# Altium project PSU4PSU.PrjPcb
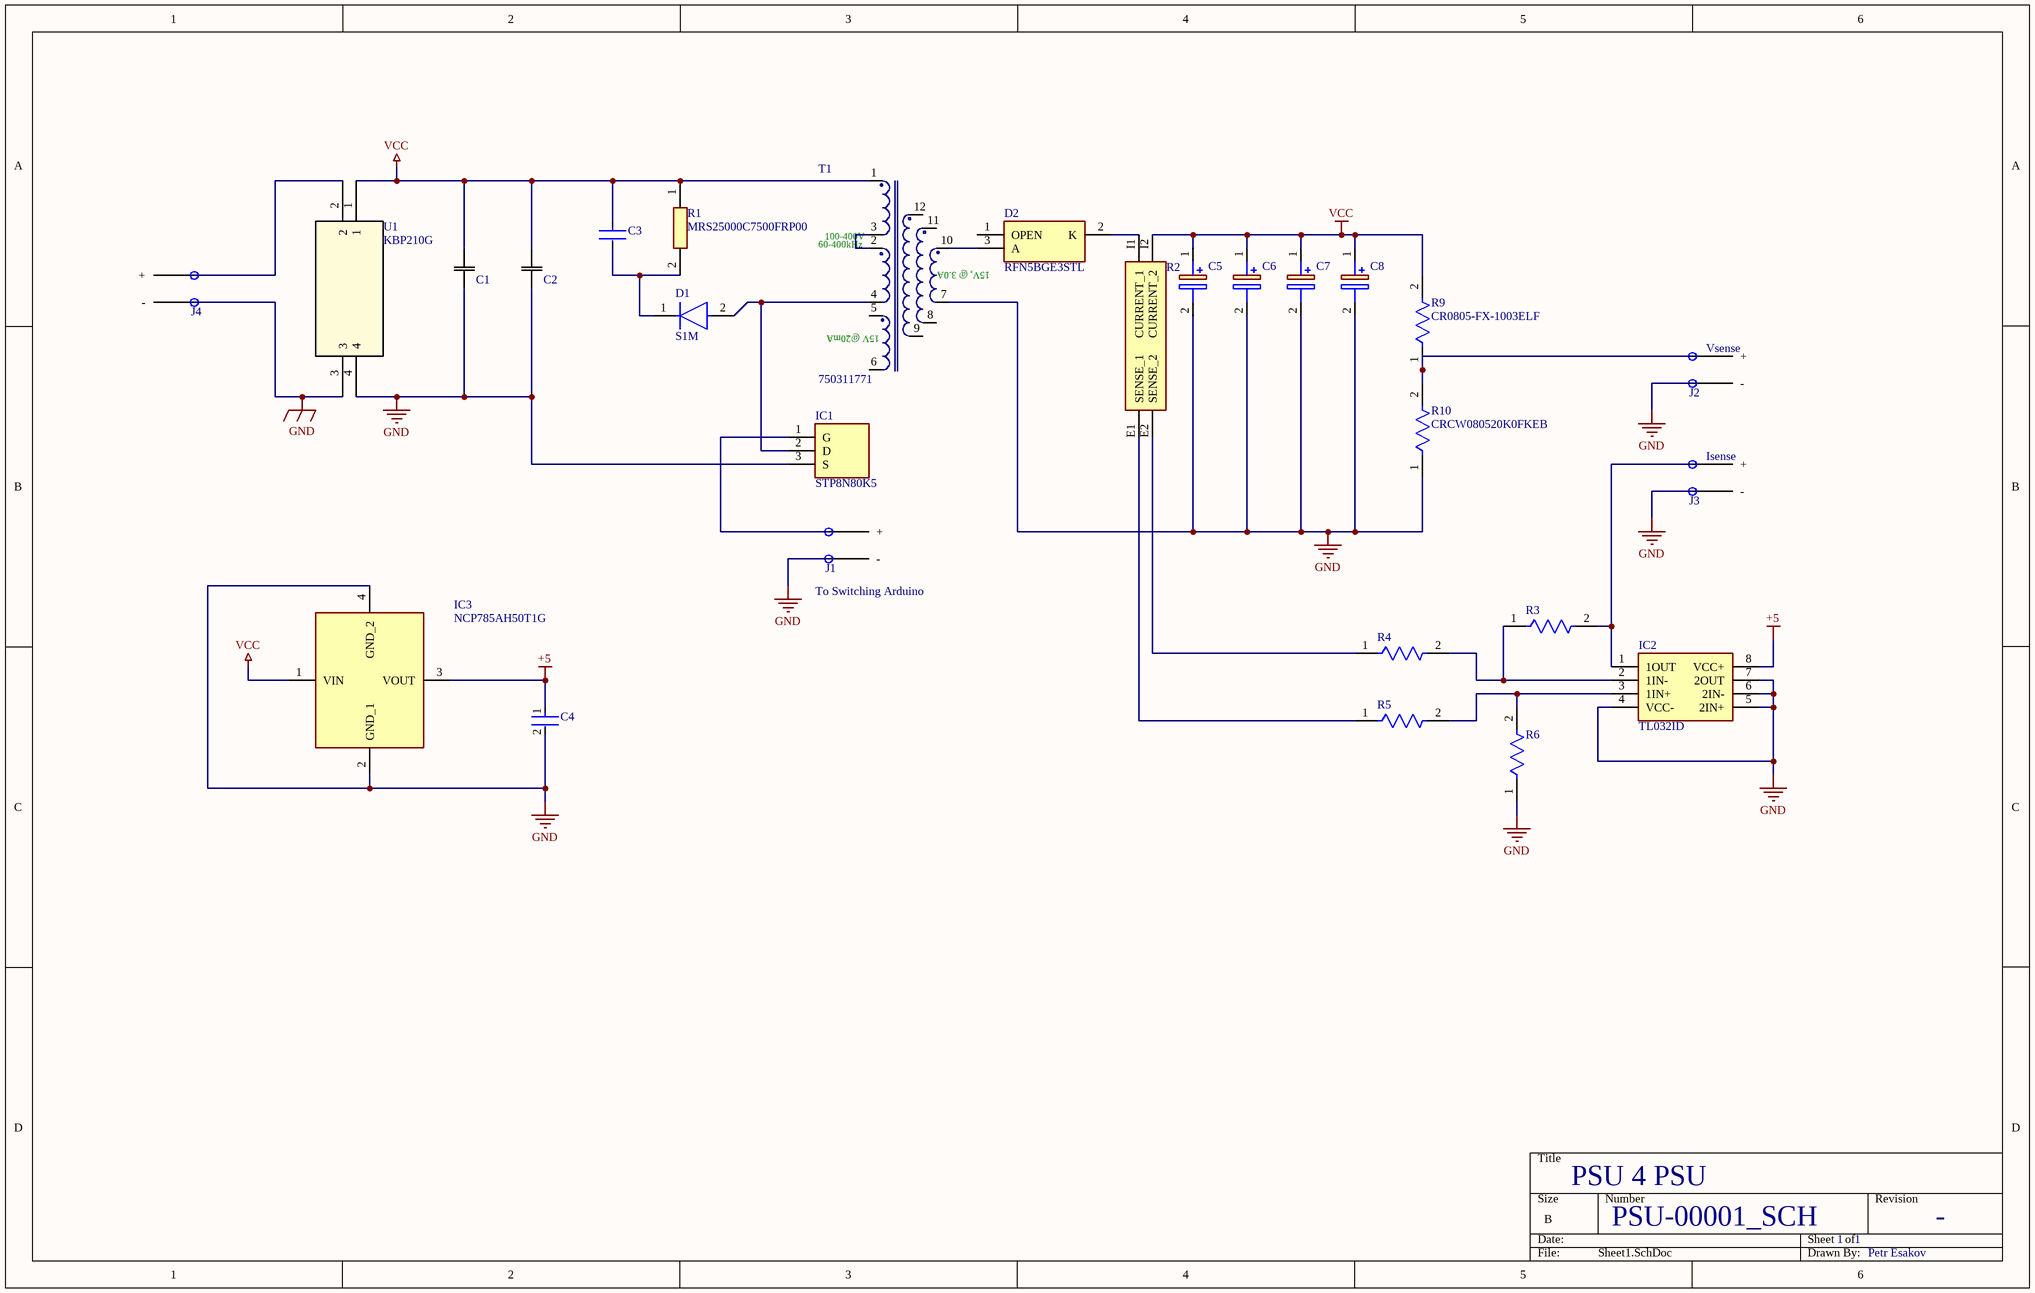
[diagram p0: Sheet1.SchDoc]
1 sheet, 27 parts. Net scope: global (net labels, ports and power ports of the same name join across sheets).

## Sheet Sheet1.SchDoc
size B; SheetNumber: 1; SheetTotal: 1

### Parts
C1  500HXW100MEFR18X45  [CAP_HXW_18X45_RUB]  (value not drawn)
C2  500HXW100MEFR18X45  [CAP_HXW_18X45_RUB]  (value not drawn)
C3  GRM55DR72D105KW01L  [FP-GRM55D-0_4-MFG]  (value not drawn)
C4  CGA6M3X7R2E104K200AE  [FP-CGA6P-IPC_A]  (value not drawn)
C5  EGXF630ELL511MK25S  [CAPPRD500W60D1275H2650]  (value not drawn)
C6  EGXF630ELL511MK25S  [CAPPRD500W60D1275H2650]  (value not drawn)
C7  EGXF630ELL511MK25S  [CAPPRD500W60D1275H2650]  (value not drawn)
C8  EGXF630ELL511MK25S  [CAPPRD500W60D1275H2650]  (value not drawn)
D1  S1M  [FP-403AE-MFG]
D2  RFN5BGE3STL  [RD3P175SNFRATL]
IC1  STP8N80K5  [TO255P460X1020X2008-3P]
IC2  TL032ID  [SOIC127P600X175-8N]
IC3  NCP785AH50T1G  [NCP785AH50T1G]
J1  Component_1  [PCBComponent_1]  (value not drawn)
J2  Component_1  [PCBComponent_1]  (value not drawn)
J3  Component_1  [PCBComponent_1]  (value not drawn)
J4  Component_1  [PCBComponent_1]  (value not drawn)
R1  MRS25000C7500FRP00  [RESAD1650W60L650D250]
R2  Y14870R10000B9R  [Y14870R10000B9R]  (value not drawn)
R3  CRCW0805330KFKEA  [FP-CRCW0805-e3-MFG]  (value not drawn)
R4  CRCW080520K0FKEB  [FP-CRCW0805-e3-IPC_B]  (value not drawn)
R5  CRCW080520K0FKEB  [FP-CRCW0805-e3-IPC_B]  (value not drawn)
R6  CRCW0805330KFKEA  [FP-CRCW0805-e3-MFG]  (value not drawn)
R9  CR0805-FX-1003ELF  [FP-CR0805-IPC_B]
R10  CRCW080520K0FKEB  [FP-CRCW0805-e3-IPC_B]
T1  750311771  [EFD25]
U1  KBP210G  [TO_P2005G_DIO]

### Nets
+5: C4.1 IC2.8(VCC+) IC3.3(VOUT)
GND: C1.1 C2.1 C4.2 C5.2(-) C6.2(-) C7.2(-) C8.2(-) IC1.3(S) IC2.4(VCC-) IC2.5(2IN+) IC2.6(2IN-) IC2.7(2OUT) IC3.2(GND_1) IC3.4(GND_2) J1.1(-) J2.1(-) J3.1(-) J4.1(-) R6.1 R10.1 T1.7 U1.3 U1.4
VCC: C1.2 C2.2 C3.1 C5.1(+) C6.1(+) C7.1(+) C8.1(+) IC3.1(VIN) R1.1 R2.I2(CURRENT_2) R9.2 T1.1 U1.1
NetC3_2: C3.2 D1.1(C) R1.2
NetD1_2: D1.2(A) IC1.2(D) T1.4
NetD2_2: D2.2(K) R2.I1(CURRENT_1)
NetD2_3: D2.3(A) T1.10
NetIC1_1: IC1.1(G) J1.0(+)
NetIC2_1: IC2.1(1OUT) J3.0(+) R3.2
NetIC2_2: IC2.2(1IN-) R3.1 R4.2
NetIC2_3: IC2.3(1IN+) R5.2 R6.2
NetJ2_0: J2.0(+) R9.1 R10.2
NetJ4_0: J4.0(+) U1.2
NetR2_E1: R2.E1(SENSE_1) R5.1
NetR2_E2: R2.E2(SENSE_2) R4.1
NetT1_2: T1.2 T1.3

Not connected (* = marked no-connect by the designer): D2 1(OPEN); T1 5 6 8 9 11 12

### Notes on the sheet
- (near J2) Vsense
- (near J3) Isense
- (near J1) To Switching Arduino
- PSU 4 PSU
- PSU-00001_SCH
- 1
- -
- Petr Esakov
- (in symbol CMP-1360-00010-1) 60-400kHz; 15V, @ 3.0A; 15V @20mA

### Library data of the parts
C1 C2 = 500HXW100MEFR18X45: No Description Available; Mfr_Name: Rubycon; Digi-Key_Part_Number_1: 1189-4253-ND; Supplier 1: Mouser; Supplier Part Number 1: 232-0HXW100MEFR18X45
C3 = CMP-06035-005143-1: Chip Multilayer Ceramic Capacitors for General Purpose, 2220, 1.0uF, X7R, 15%, 10%, 200V; Capacitance: 1uF; Voltage Rating: 200V; Length: 0.224inch; Case/Package: 2220; Min Operating Temperature: -55°C; Mount: Surface Mount; Tolerance: 10%; Packaging: Tape and Reel; Width: 0.197inch; Thickness: 0.091inch; Max Operating Temperature: 125°C
C4 = CMP-08246-002289-1: Cap Ceramic 100nF 250V X7R 10% Pad SMD 1210 +125°C Automotive T/R; Case Code (Metric): 3225; Tolerance: 10%; Max Operating Temperature: 125°C; Termination: SMD/SMT; Ratings: AEC-Q200; Voltage Rating: 250V; Case/Package: 1210; Features: Soft Termination; Depth: 2.5mm; Width: 0.098inch; Length: 3.2mm; Weight: 0.000564oz; Packaging: Tape and Reel; Thickness: 0.087inch; Min Operating Temperature: -55°C; Case Code (Imperial): 1210; Voltage Rating (DC): 250V; Height: 2mm; Capacitance: 100nF; Dielectric: X7R; Mount: Surface Mount; Package Quantity: 1
C5-C8 = EGXF630ELL511MK25S: Capacitor Polarised; Manufacturer_Name: Chemi-Con; Datasheet Link: https://www.mouser.com/datasheet/2/420/United-Chemi-Con-1016798.pdf; Height: 26.5mm; Manufacturer_Part_Number: EGXF630ELL511MK25S; Mouser Part Number: 661-EGXF630ELL511MK2; Mouser Price/Stock: https://www.mouser.co.uk/ProductDetail/United-Chemi-Con/EGXF630ELL511MK25S?qs=8BXZADTIn4FuMrtucNpwhg%3D%3D
  C5: Supplier 1: Mouser; Supplier Part Number 1: 661-EGXF630ELL511MK2
D1 = CMP-2000-04942-3: DIODE GEN PURP 1KV 1A SMA; Element Configuration: Single; Peak Non-Repetitive Surge Current: 30A; Polarity: Standard; Max Surge Current: 40A; Forward Voltage: 1.1V; Capacitance: 12pF; Power Dissipation: 1.4W; Reverse Recovery Time: 1.8us; Peak Reverse Current: 1uA; Recovery Time: 1800ns; Contact Plating: Tin; Termination: SMD/SMT; Forward Current: 1A; Case/Package: SMA; Package Quantity: 1; Length: 4.75mm; Lead Free: Lead Free; Max Reverse Voltage (DC): 1kV; Reverse Voltage: 1kV; Height: 2.2mm; Current Rating: 1A; Number of Pins: 2; Max Operating Temperature: 150°C; Mount: Surface Mount; Max Forward Surge Current (Ifsm): 30A; Width: 5.28mm; Max Repetitive Reverse Voltage (Vrrm): 1kV; Current: 1A; Voltage: 1kV; Voltage Rating (DC): 1kV; REACH SVHC: No SVHC; Min Operating Temperature: -55°C; Packaging: Tape and Reel; Output Current: 1A; Radiation Hardening: No; Average Rectified Current: 1A
D2 = RFN5BGE3STL: Diode; Manufacturer_Name: ROHM Semiconductor; Datasheet Link: https://fscdn.rohm.com/en/products/databook/datasheet/discrete/diode/fast_recovery/rfn5bge3s-e.pdf; Manufacturer_Part_Number: RFN5BGE3STL; Mouser Part Number: 755-RFN5BGE3STL; Mouser Price/Stock: https://www.mouser.co.uk/ProductDetail/ROHM-Semiconductor/RFN5BGE3STL?qs=gTYE2QTfZfS830v3%252BAHYoA%3D%3D; Supplier 1: Mouser; Supplier Part Number 1: 755-RFN5BGE3STL
IC1 = STP8N80K5: Integrated Circuit; Manufacturer_Name: STMicroelectronics; Datasheet Link: https://www.st.com/resource/en/datasheet/stp8n80k5.pdf; Height: 4.6mm; Manufacturer_Part_Number: STP8N80K5; Mouser Part Number: 511-STP8N80K5; Mouser Price/Stock: https://www.mouser.co.uk/ProductDetail/STMicroelectronics/STP8N80K5?qs=RzIIFhRKomv5IC85NofN1A%3D%3D; Supplier 1: Mouser; Supplier Part Number 1: 511-STU8N80K5
IC2 = TL032ID: Integrated Circuit; Manufacturer_Name: Texas Instruments; Datasheet Link: http://www.ti.com/lit/ds/symlink/tl032.pdf; Height: 1.75mm; Manufacturer_Part_Number: TL032ID; Mouser Part Number: 595-TL032ID; Mouser Price/Stock: https://www.mouser.co.uk/ProductDetail/Texas-Instruments/TL032ID?qs=RZS%252BpEsUn7pGfb6fvXIvLw%3D%3D; Arrow Part Number: TL032ID; Arrow Price/Stock: https://www.arrow.com/en/products/tl032id/texas-instruments; Supplier 1: Mouser; Supplier Part Number 1: 595-TL032ID
IC3 = NCP785AH50T1G: Integrated Circuit; Manufacturer_Name: onsemi; Datasheet Link: http://www.mouser.com/ds/2/308/NCP785A-D-532012.pdf; Height: 1.6mm; Manufacturer_Part_Number: NCP785AH50T1G; Mouser Part Number: 863-NCP785AH50T1G; Mouser Price/Stock: https://www.mouser.co.uk/ProductDetail/onsemi/NCP785AH50T1G?qs=k6dkFvHqcvALNdsDcRACbw%3D%3D; Arrow Part Number: NCP785AH50T1G; Arrow Price/Stock: https://www.arrow.com/en/products/ncp785ah50t1g/on-semiconductor?region=nac; Supplier 1: Mouser; Supplier Part Number 1: 863-NCP785AH50T1G
R1 = MRS25000C7500FRP00: Resistor; Manufacturer_Name: Vishay; Datasheet Link: http://www.vishay.com/docs/28724/mrs16m25.pdf; Manufacturer_Part_Number: MRS25000C7500FRP00; Supplier 1: Mouser; Supplier Part Number 1: 594-MRS25000C7500FRP
R2 = Y14870R10000B9R: Resistor; Manufacturer_Name: Vishay; Datasheet Link: http://uk.rs-online.com/web/p/products/6841649; Height: 0.635mm; Manufacturer_Part_Number: Y14870R10000B9R; Mouser Part Number: 71-CSM25120R1000BST; Mouser Price/Stock: https://www.mouser.co.uk/ProductDetail/Vishay-Precision-Group-Foil-Resistors/Y14870R10000B9R?qs=eqe8eff%252BweTiXYXyeP50BA%3D%3D; Arrow Part Number: Y14870R10000B9R; Arrow Price/Stock: https://www.arrow.com/en/products/y14870r10000b9r/vishay-precision-group?region=nac; Supplier 1: Mouser; Supplier Part Number 1: 71-CSM25120R1000BST
R3 R6 = CMP-2001-03821-2: RES Thick Film, 330kΩ, 1%, 0.125W, 100ppm/°C, 0805; Power Rating: 125mW; Resistance: 330kR; Voltage Rating (DC): 150V; Case Code (Metric): 2012; Contact Plating: Tin; Composition: Thick Film; Length: 2mm; Radiation Hardening: No; Height: 0.45mm; Max Operating Temperature: 155°C; Lead Free: Lead Free; Packaging: Tape and Reel; Depth: 1.25mm; Tolerance: 1%; Width: 1.25mm; Termination: SMD/SMT; Case Code (Imperial): 0805; Case/Package: 0805; Voltage Rating: 150V; Weight: 0.000194oz; Package Quantity: 5000; Temperature Coefficient: 100ppm/°C; Military Standard: Not; Min Operating Temperature: -55°C
R4 R5 R10 = CMP-2001-04226-2: RES Thick Film, 20kΩ, 1%, 0.125W, 100ppm/°C, 0805; Max Power Dissipation: 125mW; Resistance: 20kR; Voltage Rating: 150V; Number of Pins: 2; Case Code (Imperial): 0805; Number of Terminations: 2; Max Operating Temperature: 155°C; Case Code (Metric): 2012; Tolerance: 1%; Composition: Thick Film; Temperature Coefficient: 100ppm/°C; Min Operating Temperature: -55°C; Package Quantity: 10000; Length: 0.079inch; Width: 0.049inch; Voltage Rating (DC): 150V; Power Rating: 125mW; Packaging: Tape and Reel; Case/Package: 0805; Features: Automotive AEC-Q200; Lead Free: Lead Free; Height: 0.02inch; Weight: 0.000194oz
R9 = CMP-1013-00736-2: Thick Film Chip Resistors 0805 100kΩ 0.125W 1% 100ppm/°C; Max Power Dissipation: 125mW; Resistance: 100kR; Voltage Rating: 150V; Voltage Rating (DC): 100V; Case Code (Imperial): 0805; Tolerance: 1%; Package Quantity: 5000; Temperature Coefficient: 100ppm/°C; Thickness: 508um; Packaging: Tape and Reel; Radiation Hardening: No; Number of Terminations: 2; Features: Moisture Resistant; Power Rating: 125mW; Case Code (Metric): 2012; Termination: SMD/SMT; Height: 0.5mm; Min Operating Temperature: -55°C; Length: 2mm; Max Operating Temperature: 155°C; Case/Package: 0805; Depth: 1.25mm; Contact Plating: Tin; Mount: Surface Mount; Composition: Thick Film; REACH SVHC: No SVHC; Width: 1.25mm; Number of Pins: 2
T1 = CMP-1360-00010-1: Flyback Transformer suitable or LT3573/ LT3574/ LT3575/ LT3748 WE-FB, Ui=100-400V; Manufacturer: Wuerth Elektronik; PackageReference: EFD25; ComponentLink1URL: http://www.we-online.com; ComponentLink1Description: Manufacturer URL; ComponentLink2URL: http://katalog.we-online.de/pbs/datasheet/750311771.pdf; PartNumber: 750311771; ComponentLink2Description: Datasheet; Ui: 100-400V
U1 = KBP210G: No Description Available; Mfr_Name: Diodes Inc; Digi-Key_Part_Number_4: KBP210GGS-ND; Digi-Key_Part_Number_3: 2796-KBP210G-ND; Digi-Key_Part_Number_1: KBP210GDI-ND; Digi-Key_Part_Number_2: 2721-KBP210G-ND; RefDes: RefDes; Type: Type; Supplier 1: Mouser; Supplier Part Number 1: 621-KBP210G